# Altium schematic sheet Regulators and Buck Converters.SchDoc
size A4; SheetNumber: 19; SheetTotal: 26
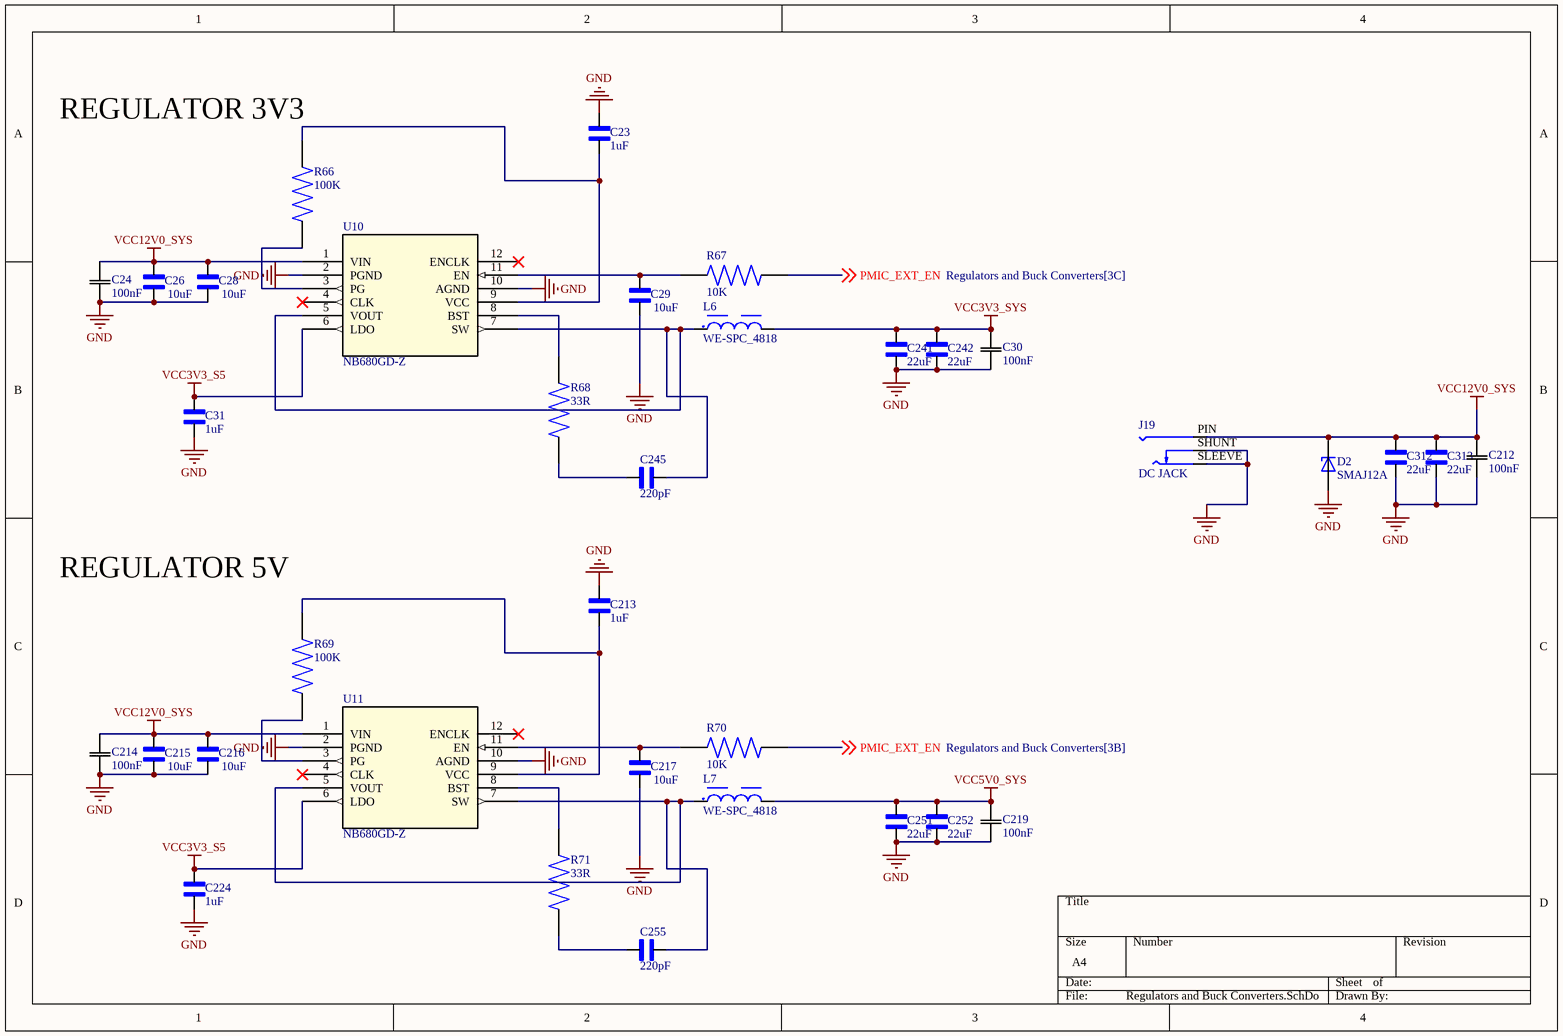
[diagram p0: Regulators and Buck Converters.SchDoc]

## Parts
C23  1uF  [CAPC1005X56N]
C24  100nF  [CAP_1005_TDK]
C26  10uF  [CAPC1005X70N]
C28  10uF  [CAPC1005X70N]
C29  10uF  [CAPC1005X70N]
C30  100nF  [CAP_1005_TDK]
C31  1uF  [CAPC1005X56N]
C212  100nF  [CAP_1005_TDK]
C213  1uF  [CAPC1005X56N]
C214  100nF  [CAP_1005_TDK]
C215  10uF  [CAPC1005X70N]
C216  10uF  [CAPC1005X70N]
C217  10uF  [CAPC1005X70N]
C219  100nF  [CAP_1005_TDK]
C224  1uF  [CAPC1005X56N]
C241  22uF  [CAPC2012X140N]
C242  22uF  [CAPC2012X140N]
C245  220pF  [CAPC1608X90]
C251  22uF  [CAPC2012X140N]
C252  22uF  [CAPC2012X140N]
C255  220pF  [CAPC1608X90]
C312  22uF  [CAPC2012X140N]
C313  22uF  [CAPC2012X140N]
D2  SMAJ12A  [DIOM4325X250N]
J19  DC JACK  [SWITCHCRAFT_RASM712PX]
L6  WE-SPC_4818  [WE-SPC_4818]
L7  WE-SPC_4818  [WE-SPC_4818]
R66  100K  [RES_ERA3ARB103V]
R67  10K  [RES_ERA3ARB103V]
R68  33R  [RES_ERA6AHD330V]
R69  100K  [RES_ERA3ARB103V]
R70  10K  [RES_ERA3ARB103V]
R71  33R  [RES_ERA6AHD330V]
U10  NB680GD-Z  [QFN-12_NB680_MNP]
U11  NB680GD-Z  [QFN-12_NB680_MNP]

## Nets
GND: C23.2 C24.1 C26.1 C28.1 C29.1 C30.1 C31.1 C212.1 C213.2 C214.1 C215.1 C216.1 C217.1 C219.1 C224.1 C241.2 C242.2 C251.2 C252.2 C312.2 C313.2 D2.A J19.SHUNT J19.SLEEVE U10.2(PGND) U10.10(AGND) U11.2(PGND) U11.10(AGND)
VCC3V3_S5: C31.2 C224.2 U10.6(LDO) U11.6(LDO)
VCC3V3_SYS: C30.2 C241.1 C242.1 L6.2
VCC5V0_SYS: C219.2 C251.1 C252.1 L7.2
VCC12V0_SYS: C24.2 C26.2 C28.2 C212.2 C214.2 C215.2 C216.2 C312.1 C313.1 D2.C J19.PIN U10.1(VIN) U11.1(VIN)
PMIC_EXT_EN: R67.2 R70.2 ; off-sheet PMIC_EXT_EN
NetC23_1: C23.1 R66.2 U10.9(VCC)
NetC29_2: C29.2 R67.1 U10.11(EN)
NetC213_1: C213.1 R69.2 U11.9(VCC)
NetC217_2: C217.2 R70.1 U11.11(EN)
NetC245_1: C245.1 L6.1 U10.5(VOUT) U10.7(SW)
NetC245_2: C245.2 R68.1
NetC255_1: C255.1 L7.1 U11.5(VOUT) U11.7(SW)
NetC255_2: C255.2 R71.1
NetR66_1: R66.1 U10.3(PG)
NetR68_2: R68.2 U10.8(BST)
NetR69_1: R69.1 U11.3(PG)
NetR71_2: R71.2 U11.8(BST)

Not connected (* = marked no-connect by the designer): U10 4(CLK)* 12(ENCLK)*; U11 4(CLK)* 12(ENCLK)*

## Notes on the sheet
- REGULATOR 3V3
- REGULATOR 5V

## Library data of the parts
C23 C31 C213 C224 = 0402ZD105KAT4A: 1 ÂµF Â±10% 10V Ceramic Capacitor X5R 0402 (1005 Metric); MF: AVX; SnapEDA_Link: https://www.snapeda.com/parts/0402ZD105KAT4A/AVX/view-part/?ref=snap; Package: 1005 AVX; Value: *; MP: 0402ZD105KAT4A; Check_prices: https://www.snapeda.com/parts/0402ZD105KAT4A/AVX/view-part/?ref=eda
C24 C30 C212 C214 C219 = C1005X7R1H104M050BB: Description; Manufacturer_Name: TDK; Copyright: Copyright (C) 2025 Ultra Librarian. All rights reserved.; Manufacturer_Part_Number: C1005X7R1H104M050BB
C26 C28 C29 C215-C217 = CL05A106MQ5NUNC: 10 ÂµF Â±20% 6.3V Ceramic Capacitor X5R 0402 (1005 Metric); MF: Samsung; SnapEDA_Link: https://www.snapeda.com/parts/CL05A106MQ5NUNC/Samsung/view-part/?ref=snap; Package: SMD-2 Samsung; Value: *; MP: CL05A106MQ5NUNC; Check_prices: https://www.snapeda.com/parts/CL05A106MQ5NUNC/Samsung/view-part/?ref=eda
C241 C242 C251 C252 C312 C313 = C0805C220J5GACTU: Capacitor, Ceramic, Cap, 22.0pF, Tol 5%, SMT, 50V, C0G | KEMET C0805C220J5GACTU; SnapEDA_Link: https://www.snapeda.com/parts/C0805C220J5GACTU/KEMET/view-part/?ref=snap; Package: 0805 Kemet; Value: *; MF: KEMET; MP: C0805C220J5GACTU; Check_prices: https://www.snapeda.com/parts/C0805C220J5GACTU/KEMET/view-part/?ref=eda
C245 C255 = CC0603KRX7R7BB221: 220 pF Â±10% 16V Ceramic Capacitor X7R 0603 (1608 Metric); MF: Yageo; SnapEDA_Link: https://www.snapeda.com/parts/CC0603KRX7R7BB221/Yageo/view-part/?ref=snap; Package: 0603 Yageo; Value: *; MP: CC0603KRX7R7BB221; Check_prices: https://www.snapeda.com/parts/CC0603KRX7R7BB221/Yageo/view-part/?ref=eda
D2 = SMAJ12A: 400W, 14V, 5%, Unidirectional, TVS; MF: Taiwan Semiconductor; SnapEDA_Link: https://www.snapeda.com/parts/SMAJ12A/taiwan/view-part/?ref=snap; Package: SMA-2 Taiwan Semiconductor; Value: *; MP: SMAJ12A; Check_prices: https://www.snapeda.com/parts/SMAJ12A/taiwan/view-part/?ref=eda
J19 = RASM712PX: Conn;AV;DC,Power;Jack;2.5mmPinSize;RtAngle;DCSeries;SMTMount | Switchcraft RASM712PX; MF: Switchcraft Inc.; SnapEDA_Link: https://www.snapeda.com/parts/RASM712PX/SWITCHCRAFT/view-part/?ref=snap; Package: None; Value: *; MP: RASM712PX; Check_prices: https://www.snapeda.com/parts/RASM712PX/SWITCHCRAFT/view-part/?ref=eda
L6 L7 = WE-SPC_4818: 10 ÂµH Shielded Drum Core, Wirewound Inductor 900 mA 248mOhm Max 1919 (4848 Metric); MF: WÃ¼rth Elektronik; MP: 74408941100; SnapEDA_Link: https://www.snapeda.com/parts/74408941100/W%25C3%25BCrth+Elektronik+Midcom/view-part/?ref=snap; Package: 1919 WÃ¼rth Elektronik; Value: *; Check_prices: https://www.snapeda.com/parts/74408941100/W%25C3%25BCrth+Elektronik+Midcom/view-part/?ref=eda
R66 R67 R69 R70 = ERA3ARB103V: MP: ERA3ARB103V; Availability: Unavailable; Package: None; Value: *; Price: None
R68 R71 = ERA6AHD330V: Package: None; MP: ERA6AHD330V; Price: None; Value: *; Availability: Unavailable
U10 U11 = NB680GD-Z: Wide Vin 4.8-26V Low Iq High Current Fixed 3.3V-8A Synchronous Buck Converter with 100mA LDO; Manufacturer_Name: Monolithic Power Systems; Copyright: Copyright (C) 2026 Ultra Librarian. All rights reserved.; Manufacturer_Part_Number: NB680GD-Z; Datasheet: https://www.monolithicpower.com/en/documentview/productdocument/index/version/2/document_type/Datasheet/lang/en/sku/NB680; RefDes: RefDes; Type: Type